# Altium schematic sheet payload_esp32.SchDoc (part 2 of 4)
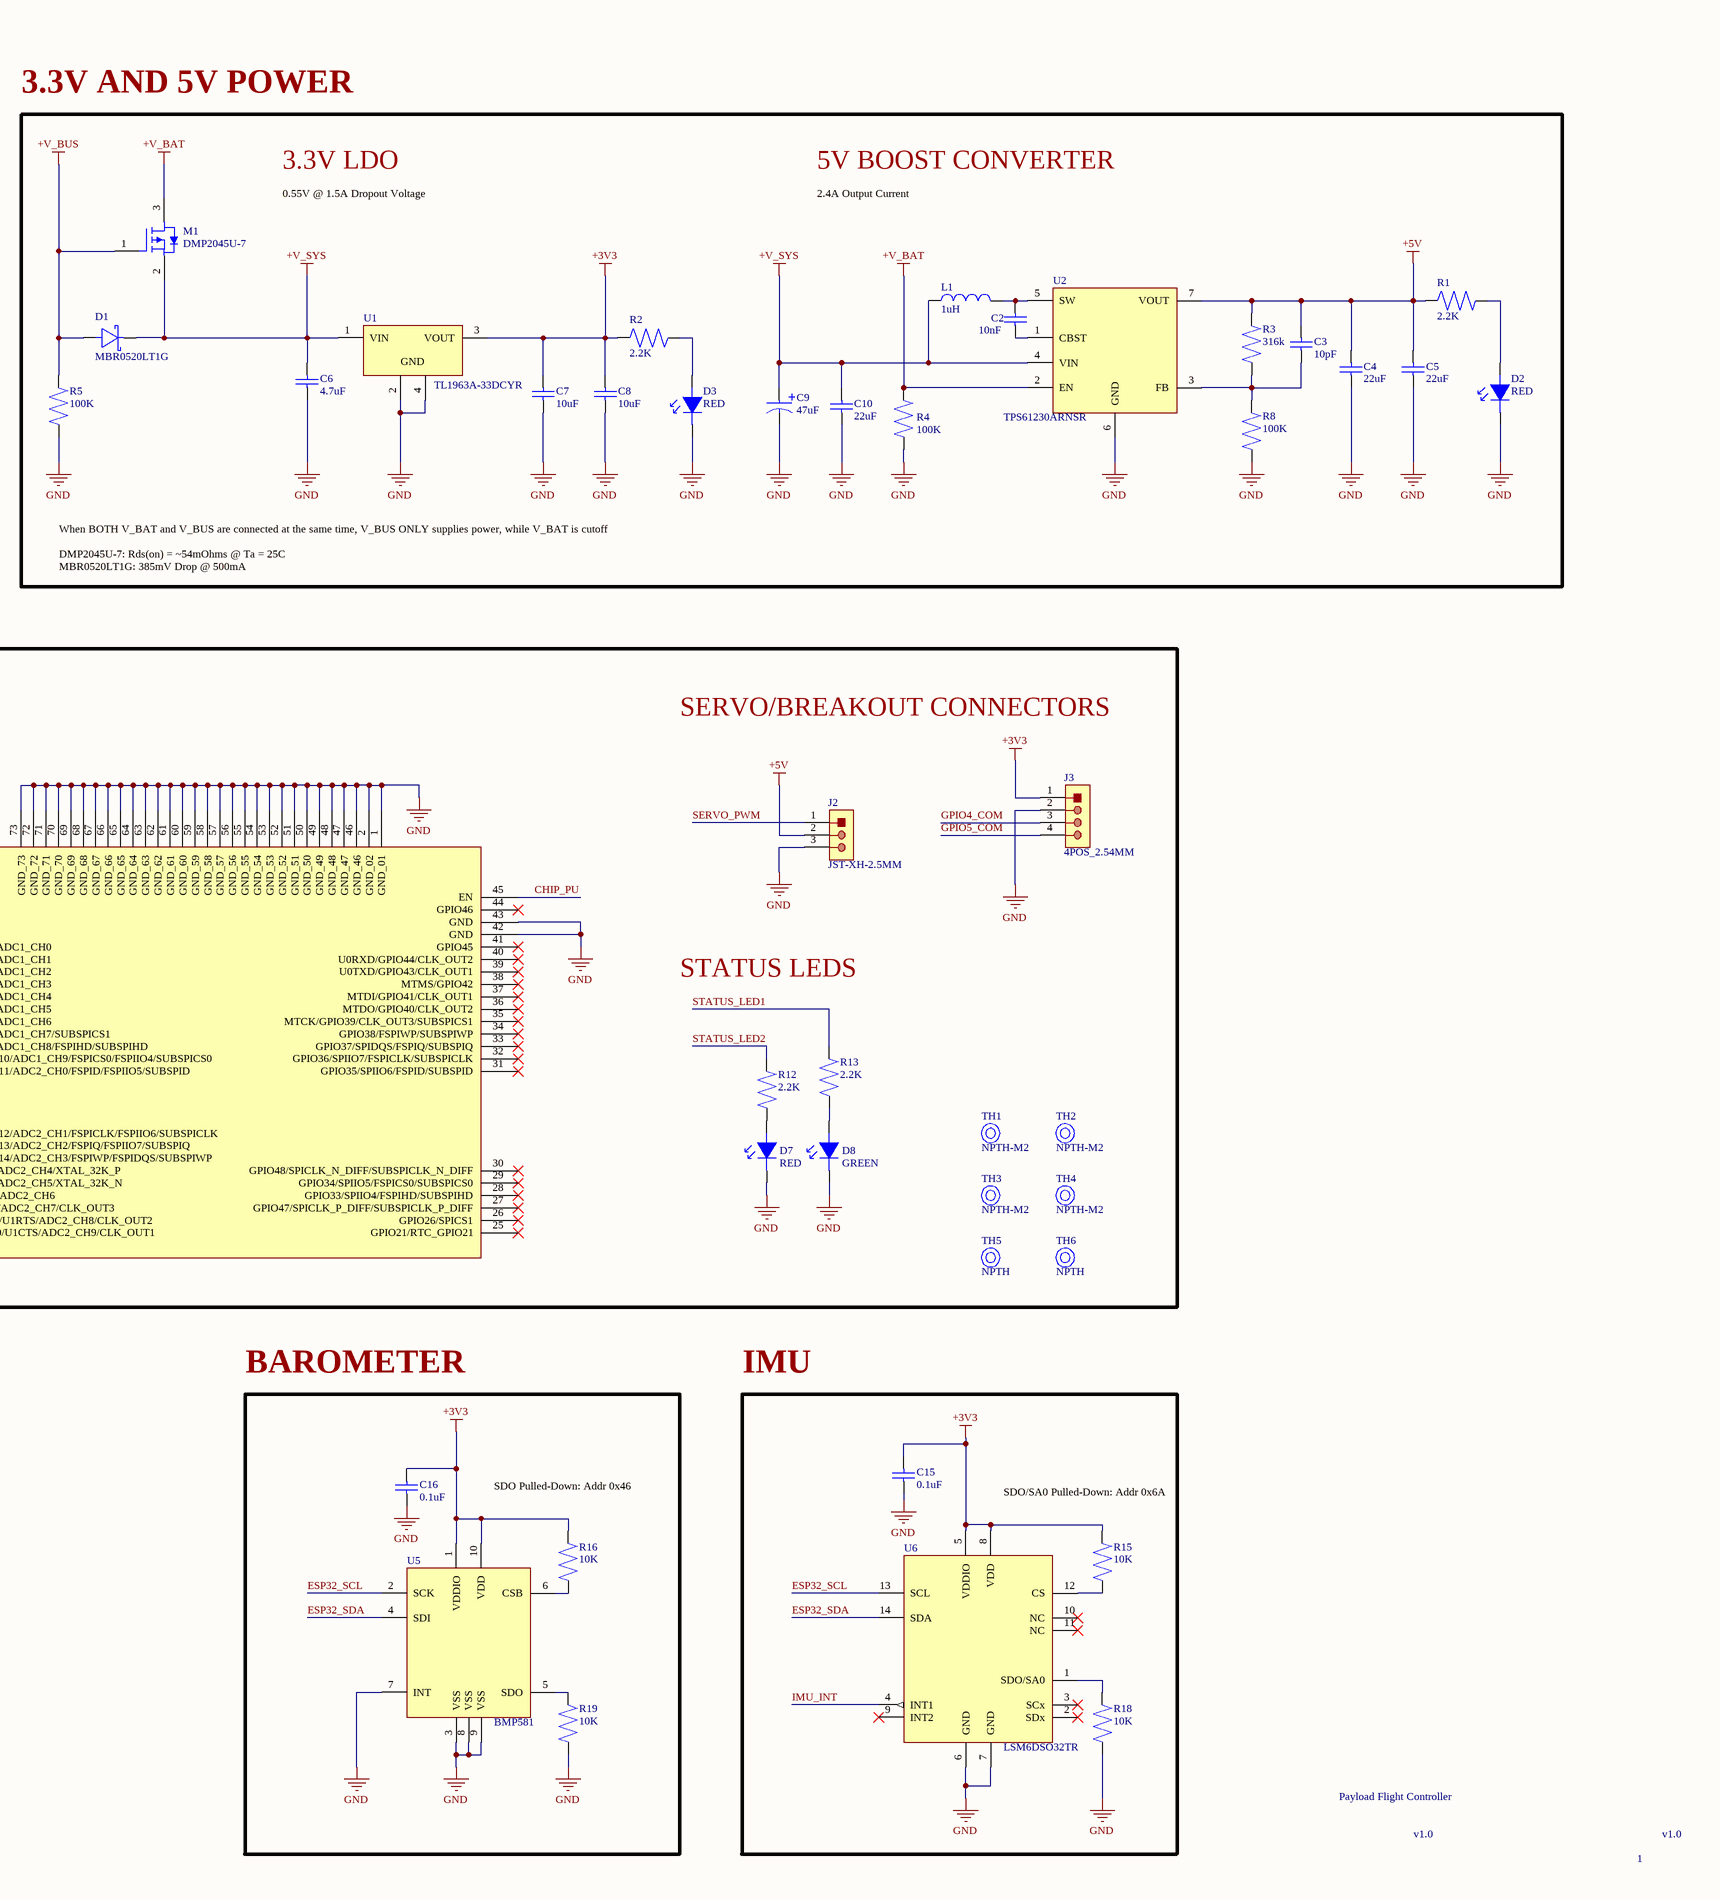
[diagram p2: payload_esp32.SchDoc, right]
## Library data of the parts
C1 C12 C14-C16 = CL05A104KP5NNNC: CAP CER 0.1UF 10V X5R 0402; Manufacturer: Samsung Electro-Mechanics; Value: 100nF; Dielectric Material: Ceramic; Tolerance: 10%; Supplier: DigiKey; Supplier Part Number: 1276-1022-1-ND; Manufacturer Part Number: CL05A104KP5NNNC; RoHS: Compliant; Category: Ceramic Capacitors; Stock: 423340; Pricing: 1=0.1, 10=0.018, 50=0.0118, 100=0.0099, 500=0.00686, 1000=0.00591, 2500=0.00494, 5000=0.00435 (USD); Case/Package: 0402; Case Code (Imperial): 0402; Case Code (Metric): 1005; China RoHS: Compliant; Contact Plating: Tin; Country of Origin: Mainland China, Philippines, South Korea; Depth: 500µm; Dielectric: X5R; Export Control Classification Number (ECCN) Code: EAR99; Height: 550µm; Harmonized Tariff Schedule (HTS) Code: 8532.24.00.20; Introduction Date: 2005-12-01; Length: 1mm; Lifecycle Status: Production; Material: Ceramic; Max Operating Temperature: 85°C; Min Operating Temperature: -55°C; Mounting Technology: Surface Mount; Number of Terminals: 2; Radiation Hardening: No; REACH SVHC: Yes; Schedule B: 8532240020, 8532240020|8532240020, 8532240020|8532240020|8532240020, 8532240020|8532240020|8532240020|8532240020; Thickness: 558.8µm; Voltage Rating: 10V; Voltage Rating (DC): 10V; Width: 500µm; ComponentLink1URL: https://datasheet.octopart.com:443/CL05A104KP5NNNC-Samsung-Electro-Mechanics-datasheet-136031717.pdf?src-supplier=IHS; ComponentLink1Description: https://datasheet.octopart.com:443/CL05A104KP5NNNC-Samsung-Electro-Mechanics-datasheet-136031717.pdf?src-supplier=IHS; ComponentLink2URL: https://datasheet.octopart.com:443/CL05A104KP5NNNC-Samsung-Electro-Mechanics-datasheet-11780788.pdf?src-supplier=Future+Electronics; ComponentLink2Description: https://datasheet.octopart.com:443/CL05A104KP5NNNC-Samsung-Electro-Mechanics-datasheet-11780788.pdf?src-supplier=Future+Electronics; ComponentLink3URL: https://datasheet.octopart.com:443/CL05A104KP5NNNC-Samsung-Electro-Mechanics-datasheet-110226197.pdf?src-supplier=Future+Electronics; ComponentLink3Description: https://datasheet.octopart.com:443/CL05A104KP5NNNC-Samsung-Electro-Mechanics-datasheet-110226197.pdf?src-supplier=Future+Electronics; ComponentLink4URL: https://datasheet.octopart.com:443/CL05A104KP5NNNC-Samsung-Electro-Mechanics-datasheet-81461587.pdf?src-supplier=Future+Electronics; ComponentLink4Description: https://datasheet.octopart.com:443/CL05A104KP5NNNC-Samsung-Electro-Mechanics-datasheet-81461587.pdf?src-supplier=Future+Electronics; ComponentLink5URL: https://datasheet.octopart.com:443/CL05A104KP5NNNC-Samsung-datasheet-42280511.pdf?src-supplier=Future+Electronics; ComponentLink5Description: https://datasheet.octopart.com:443/CL05A104KP5NNNC-Samsung-datasheet-42280511.pdf?src-supplier=Future+Electronics; ComponentLink6URL: https://datasheet.octopart.com:443/CL05A104KP5NNNC-Samsung-Electro-Mechanics-datasheet-149136630.pdf?src-supplier=Future+Electronics; ComponentLink6Description: https://datasheet.octopart.com:443/CL05A104KP5NNNC-Samsung-Electro-Mechanics-datasheet-149136630.pdf?src-supplier=Future+Electronics; ComponentLink7URL: https://datasheet.octopart.com/CL05A104KP5NNNC-Samsung-Electro-Mechanics-datasheet-8324245.pdf; ComponentLink7Description: https://datasheet.octopart.com/CL05A104KP5NNNC-Samsung-Electro-Mechanics-datasheet-8324245.pdf; ComponentLink8URL: https://datasheet.octopart.com/CL05A104KP5NNNC-Samsung-Electro-Mechanics-datasheet-97040617.pdf; ComponentLink8Description: https://datasheet.octopart.com/CL05A104KP5NNNC-Samsung-Electro-Mechanics-datasheet-97040617.pdf; ComponentLink9URL: https://datasheet.octopart.com:443/CL05A104KP5NNNC-Samsung-datasheet-59220082.pdf?src-supplier=TME; ComponentLink9Description: https://datasheet.octopart.com:443/CL05A104KP5NNNC-Samsung-datasheet-59220082.pdf?src-supplier=TME
C2 = GRM155R71C103KA01D: CAP CER 10000PF 16V X7R 0402; Manufacturer: Murata; Manufacturer Lifecycle Status: NRND; Dielectric Material: Ceramic; Tolerance: 10%; Supplier: DigiKey; Supplier Part Number: 490-1313-1-ND; Manufacturer Part Number: GRM155R71C103KA01D; RoHS: Compliant; Category: Ceramic Capacitors; Stock: 5833913; Pricing: 1=0.1, 10=0.021, 50=0.014, 100=0.0118, 500=0.00822, 1000=0.00713, 2500=0.00598, 5000=0.00529, 10000=0.0046, 20000=0.00415, 30000=0.00392, 50000=0.00367, 70000=0.00353, 100000=0.00339 (USD); Value: 10nF; Case/Package: 0402; Case Code (Imperial): 0402; Case Code (Metric): 1005; Depth: 500µm; Dielectric: X7R; Height: 500µm; Lead Free: Lead Free; Length: 1mm; Lifecycle Status: NRND; Material: Ceramic; Max Operating Temperature: 125°C; Min Operating Temperature: -55°C; Mounting Technology: Surface Mount; Pins: 2; Number of Terminals: 2; Packaging: Cut Tape; Radiation Hardening: No; REACH SVHC: Yes; Schedule B: 8532240020, 8532240020|8532240020, 8532240020|8532240020|8532240020, 8532240020|8532240020|8532240020|8532240020; Termination: SMD/SMT; Thickness: 500µm; Voltage: 16V; Voltage Rating: 16V; Voltage Rating (DC): 16V; Width: 500µm; ComponentLink1URL: https://datasheet.octopart.com:443/GRM155R71C103KA01D-Murata-datasheet-8817987.pdf?src-supplier=element14+APAC; ComponentLink1Description: https://datasheet.octopart.com:443/GRM155R71C103KA01D-Murata-datasheet-8817987.pdf?src-supplier=element14+APAC; ComponentLink2URL: https://datasheet.octopart.com:443/GRM155R71C103KA01D-Murata-datasheet-62317116.pdf?src-supplier=element14+APAC; ComponentLink2Description: https://datasheet.octopart.com:443/GRM155R71C103KA01D-Murata-datasheet-62317116.pdf?src-supplier=element14+APAC; ComponentLink3URL: https://datasheet.octopart.com:443/GRM155R71C103KA01D-Murata-datasheet-12547956.pdf?src-supplier=_legacy+Avnet; ComponentLink3Description: https://datasheet.octopart.com:443/GRM155R71C103KA01D-Murata-datasheet-12547956.pdf?src-supplier=_legacy+Avnet; ComponentLink4URL: https://datasheet.octopart.com:443/GRM155R71C103KA01D-Murata-datasheet-8330587.pdf?src-supplier=_legacy+Avnet; ComponentLink4Description: https://datasheet.octopart.com:443/GRM155R71C103KA01D-Murata-datasheet-8330587.pdf?src-supplier=_legacy+Avnet; ComponentLink5URL: https://datasheet.octopart.com:443/GRM155R71C103KA01D-Murata-datasheet-165579666.pdf?src-supplier=TME; ComponentLink5Description: https://datasheet.octopart.com:443/GRM155R71C103KA01D-Murata-datasheet-165579666.pdf?src-supplier=TME; ComponentLink6URL: https://datasheet.octopart.com:443/GRM155R71C103KA01D-Murata-datasheet-59876780.pdf?src-supplier=TME; ComponentLink6Description: https://datasheet.octopart.com:443/GRM155R71C103KA01D-Murata-datasheet-59876780.pdf?src-supplier=TME; ComponentLink7URL: https://datasheet.octopart.com:443/GRM155R71C103KA01D-Murata-datasheet-141266224.pdf?src-supplier=Ciiva; ComponentLink7Description: https://datasheet.octopart.com:443/GRM155R71C103KA01D-Murata-datasheet-141266224.pdf?src-supplier=Ciiva; ComponentLink8URL: https://datasheet.octopart.com:443/GRM155R71C103KA01D-Murata-datasheet-140690969.pdf?src-supplier=Ciiva; ComponentLink8Description: https://datasheet.octopart.com:443/GRM155R71C103KA01D-Murata-datasheet-140690969.pdf?src-supplier=Ciiva; ComponentLink9URL: https://datasheet.octopart.com:443/GRM155R71C103KA01D-Murata-datasheet-138740887.pdf?src-supplier=Ciiva; ComponentLink9Description: https://datasheet.octopart.com:443/GRM155R71C103KA01D-Murata-datasheet-138740887.pdf?src-supplier=Ciiva; ComponentLink10URL: https://datasheet.octopart.com:443/GRM155R71C103KA01D-Murata-datasheet-22122223.pdf?src-supplier=Future+Electronics; ComponentLink10Description: https://datasheet.octopart.com:443/GRM155R71C103KA01D-Murata-datasheet-22122223.pdf?src-supplier=Future+Electronics; ComponentLink11URL: https://datasheet.octopart.com:443/GRM155R71C103KA01D-Murata-datasheet-14400559.pdf?src-supplier=Future+Electronics; ComponentLink11Description: https://datasheet.octopart.com:443/GRM155R71C103KA01D-Murata-datasheet-14400559.pdf?src-supplier=Future+Electronics; ComponentLink12URL: https://datasheet.octopart.com:443/GRM155R71C103KA01D-Murata-datasheet-44106282.pdf?src-supplier=Future+Electronics; ComponentLink12Description: https://datasheet.octopart.com:443/GRM155R71C103KA01D-Murata-datasheet-44106282.pdf?src-supplier=Future+Electronics; ComponentLink13URL: https://datasheet.octopart.com/GRM155R71C103KA01D-Murata-datasheet-12515295.pdf; ComponentLink13Description: https://datasheet.octopart.com/GRM155R71C103KA01D-Murata-datasheet-12515295.pdf; ComponentLink14URL: https://datasheet.octopart.com/GRM155R71C103KA01D-Murata-datasheet-12510076.pdf; ComponentLink14Description: https://datasheet.octopart.com/GRM155R71C103KA01D-Murata-datasheet-12510076.pdf; ComponentLink15URL: https://datasheet.octopart.com/GRM155R71C103KA01D-Murata-datasheet-11978611.pdf; ComponentLink15Description: https://datasheet.octopart.com/GRM155R71C103KA01D-Murata-datasheet-11978611.pdf; ComponentLink16URL: https://datasheet.octopart.com/GRM155R71C103KA01D-Murata-datasheet-10025737.pdf; ComponentLink16Description: https://datasheet.octopart.com/GRM155R71C103KA01D-Murata-datasheet-10025737.pdf; ComponentLink17URL: https://datasheet.octopart.com/GRM155R71C103KA01D-Murata-datasheet-8819587.pdf; ComponentLink17Description: https://datasheet.octopart.com/GRM155R71C103KA01D-Murata-datasheet-8819587.pdf; ComponentLink18URL: https://datasheet.octopart.com/GRM155R71C103KA01D-Murata-datasheet-14400564.pdf; ComponentLink18Description: https://datasheet.octopart.com/GRM155R71C103KA01D-Murata-datasheet-14400564.pdf; ComponentLink19URL: https://datasheet.octopart.com:443/GRM155R71C103KA01D-Murata-datasheet-148211.pdf?src-supplier=Garrett; ComponentLink19Description: https://datasheet.octopart.com:443/GRM155R71C103KA01D-Murata-datasheet-148211.pdf?src-supplier=Garrett; ComponentLink20URL: https://datasheet.octopart.com:443/GRM155R71C103KA01D-Murata-datasheet-102.pdf?src-supplier=DigiKey; ComponentLink20Description: https://datasheet.octopart.com:443/GRM155R71C103KA01D-Murata-datasheet-102.pdf?src-supplier=DigiKey; ComponentLink21URL: http://sigma.octopart.com:80/reach_statement/Murata-company-16.pdf?src-supplier=Compliance+Statements; ComponentLink21Description: http://sigma.octopart.com:80/reach_statement/Murata-company-16.pdf?src-supplier=Compliance+Statements
C3 = GRM1885C1H100JA01D: CAP CER 10PF 50V C0G/NP0 0603; Manufacturer: Murata; Manufacturer Lifecycle Status: NRND; Dielectric: C0G; Dielectric Material: Ceramic; Insulation Resistance: 10GΩ; Temperature Coefficient: 30ppm/°C; Tolerance: 5%; Supplier: DigiKey; Supplier Part Number: 490-1403-1-ND; Manufacturer Part Number: GRM1885C1H100JA01D; RoHS: Compliant; Category: Ceramic Capacitors; Stock: 208082; Pricing: 1=0.12, 10=0.064, 50=0.0446, 100=0.0386, 500=0.02856, 1000=0.02546 (USD); Value: 10pF; Case/Package: 0603; Case Code (Imperial): 0603; Case Code (Metric): 1608; Depth: 800µm; Export Control Classification Number (ECCN) Code: EAR99; Height: 800µm; Harmonized Tariff Schedule (HTS) Code: 8532.24.00.20; Introduction Date: 2001-07-26; Lead Free: Lead Free; Length: 1.6mm; Lifecycle Status: NRND; Material: Ceramic; Max Operating Temperature: 125°C; Min Operating Temperature: -55°C; Mounting Technology: Surface Mount; Pins: 2; Number of Terminals: 2; Packaging: Cut Tape; Radiation Hardening: No; REACH SVHC: Yes; Schedule B: 8532240020, 8532240020|8532240020, 8532240020|8532240020|8532240020, 8532240020|8532240020|8532240020|8532240020; Termination: SMD/SMT; Thickness: 800µm; Voltage: 50V; Voltage Rating: 50V; Voltage Rating (DC): 50V; Width: 800µm; ComponentLink1URL: https://datasheet.octopart.com:443/GRM1885C1H100JA01D-Murata-datasheet-501912.pdf?src-supplier=element14+APAC; ComponentLink1Description: https://datasheet.octopart.com:443/GRM1885C1H100JA01D-Murata-datasheet-501912.pdf?src-supplier=element14+APAC; ComponentLink2URL: https://datasheet.octopart.com:443/GRM1885C1H100JA01D-Murata-datasheet-62320228.pdf?src-supplier=element14+APAC; ComponentLink2Description: https://datasheet.octopart.com:443/GRM1885C1H100JA01D-Murata-datasheet-62320228.pdf?src-supplier=element14+APAC; ComponentLink3URL: https://datasheet.octopart.com:443/GRM1885C1H100JA01D-Murata-datasheet-17853672.pdf?src-supplier=element14+APAC; ComponentLink3Description: https://datasheet.octopart.com:443/GRM1885C1H100JA01D-Murata-datasheet-17853672.pdf?src-supplier=element14+APAC; ComponentLink4URL: https://datasheet.octopart.com:443/GRM1885C1H100JA01D-Murata-datasheet-8326625.pdf?src-supplier=_legacy+Avnet; ComponentLink4Description: https://datasheet.octopart.com:443/GRM1885C1H100JA01D-Murata-datasheet-8326625.pdf?src-supplier=_legacy+Avnet; ComponentLink5URL: https://datasheet.octopart.com:443/GRM1885C1H100JA01D-Murata-datasheet-14397104.pdf?src-supplier=Future+Electronics; ComponentLink5Description: https://datasheet.octopart.com:443/GRM1885C1H100JA01D-Murata-datasheet-14397104.pdf?src-supplier=Future+Electronics; ComponentLink6URL: https://datasheet.octopart.com:443/GRM1885C1H100JA01D-Murata-datasheet-22122223.pdf?src-supplier=Future+Electronics; ComponentLink6Description: https://datasheet.octopart.com:443/GRM1885C1H100JA01D-Murata-datasheet-22122223.pdf?src-supplier=Future+Electronics; ComponentLink7URL: https://datasheet.octopart.com:443/GRM1885C1H100JA01D-Murata-datasheet-44106814.pdf?src-supplier=Future+Electronics; ComponentLink7Description: https://datasheet.octopart.com:443/GRM1885C1H100JA01D-Murata-datasheet-44106814.pdf?src-supplier=Future+Electronics; ComponentLink8URL: https://datasheet.octopart.com:443/GRM1885C1H100JA01D-Murata-datasheet-165579666.pdf?src-supplier=TME; ComponentLink8Description: https://datasheet.octopart.com:443/GRM1885C1H100JA01D-Murata-datasheet-165579666.pdf?src-supplier=TME; ComponentLink9URL: https://datasheet.octopart.com:443/GRM1885C1H100JA01D-Murata-datasheet-59876780.pdf?src-supplier=TME; ComponentLink9Description: https://datasheet.octopart.com:443/GRM1885C1H100JA01D-Murata-datasheet-59876780.pdf?src-supplier=TME; ComponentLink10URL: https://datasheet.octopart.com:443/GRM1885C1H100JA01D-Murata-datasheet-141274262.pdf?src-supplier=Ciiva; ComponentLink10Description: https://datasheet.octopart.com:443/GRM1885C1H100JA01D-Murata-datasheet-141274262.pdf?src-supplier=Ciiva; ComponentLink11URL: https://datasheet.octopart.com:443/GRM1885C1H100JA01D-Murata-datasheet-140695805.pdf?src-supplier=Ciiva; ComponentLink11Description: https://datasheet.octopart.com:443/GRM1885C1H100JA01D-Murata-datasheet-140695805.pdf?src-supplier=Ciiva; ComponentLink12URL: https://datasheet.octopart.com:443/GRM1885C1H100JA01D-Murata-datasheet-138741453.pdf?src-supplier=Ciiva; ComponentLink12Description: https://datasheet.octopart.com:443/GRM1885C1H100JA01D-Murata-datasheet-138741453.pdf?src-supplier=Ciiva; ComponentLink13URL: https://datasheet.octopart.com/GRM1885C1H100JA01D-Murata-datasheet-12515295.pdf; ComponentLink13Description: https://datasheet.octopart.com/GRM1885C1H100JA01D-Murata-datasheet-12515295.pdf; ComponentLink14URL: https://datasheet.octopart.com/GRM1885C1H100JA01D-Murata-datasheet-12510076.pdf; ComponentLink14Description: https://datasheet.octopart.com/GRM1885C1H100JA01D-Murata-datasheet-12510076.pdf; ComponentLink15URL: https://datasheet.octopart.com/GRM1885C1H100JA01D-Murata-datasheet-11978611.pdf; ComponentLink15Description: https://datasheet.octopart.com/GRM1885C1H100JA01D-Murata-datasheet-11978611.pdf; ComponentLink16URL: https://datasheet.octopart.com/GRM1885C1H100JA01D-Murata-datasheet-10025737.pdf; ComponentLink16Description: https://datasheet.octopart.com/GRM1885C1H100JA01D-Murata-datasheet-10025737.pdf; ComponentLink17URL: https://datasheet.octopart.com/GRM1885C1H100JA01D-Murata-datasheet-8819587.pdf; ComponentLink17Description: https://datasheet.octopart.com/GRM1885C1H100JA01D-Murata-datasheet-8819587.pdf; ComponentLink18URL: https://datasheet.octopart.com:443/GRM1885C1H100JA01D-Murata-datasheet-8213623.pdf?src-supplier=Jameco; ComponentLink18Description: https://datasheet.octopart.com:443/GRM1885C1H100JA01D-Murata-datasheet-8213623.pdf?src-supplier=Jameco; ComponentLink19URL: https://datasheet.octopart.com:443/GRM1885C1H100JA01D-Murata-datasheet-102.pdf?src-supplier=DigiKey; ComponentLink19Description: https://datasheet.octopart.com:443/GRM1885C1H100JA01D-Murata-datasheet-102.pdf?src-supplier=DigiKey; ComponentLink20URL: https://datasheet.octopart.com:443/GRM1885C1H100JA01D-Murata-datasheet-514334.pdf?src-supplier=Farnell; ComponentLink20Description: https://datasheet.octopart.com:443/GRM1885C1H100JA01D-Murata-datasheet-514334.pdf?src-supplier=Farnell; ComponentLink21URL: http://sigma.octopart.com:80/reach_statement/Murata-company-16.pdf?src-supplier=Compliance+Statements; ComponentLink21Description: http://sigma.octopart.com:80/reach_statement/Murata-company-16.pdf?src-supplier=Compliance+Statements
C4 C5 C10 = GRM21BR61A226ME44L: CAP CER 22UF 10V X5R 0805; Manufacturer: Murata; Manufacturer Lifecycle Status: IN PRODUCTION; Value: 22µF; Dielectric Material: Ceramic; Dissipation Factor: 0.035%; Tolerance: 20%; Supplier: DigiKey; Supplier Part Number: 490-10746-1-ND; Manufacturer Part Number: GRM21BR61A226ME44L; RoHS: Compliant; Category: Ceramic Capacitors; Stock: 89098; Pricing: 1=0.29, 10=0.17, 50=0.1232, 100=0.1091, 500=0.0852, 1000=0.07783 (USD); Case/Package: 0805; Case Code (Imperial): 0805; Case Code (Metric): 2012; Composition: Ceramic; Country of Origin: Philippines; Depth: 1.25mm; Dielectric: X5R; Export Control Classification Number (ECCN) Code: EAR99; Height: 1.25mm; Harmonized Tariff Schedule (HTS) Code: 8532.24.00.20; Introduction Date: 2013-11-20; Lead Free: Lead Free; Length: 2mm; Lifecycle Status: Production; Material: Ceramic; Max Operating Temperature: 85°C; Min Operating Temperature: -55°C; Mounting Technology: Surface Mount; Number of Terminals: 2; REACH SVHC: Yes; Schedule B: 8532240020, 8532240020|8532240020, 8532240020|8532240020|8532240020, 8532240020|8532240020|8532240020|8532240020; Termination: SMD/SMT; Thickness: 1.25mm; Voltage: 10V; Voltage Rating: 10V; Voltage Rating (DC): 10V; Weight: 9.49709mg; Width: 1.25mm; ComponentLink1URL: https://datasheet.octopart.com:443/GRM21BR61A226ME44L-Murata-datasheet-149523488.pdf?src-supplier=Newark; ComponentLink1Description: https://datasheet.octopart.com:443/GRM21BR61A226ME44L-Murata-datasheet-149523488.pdf?src-supplier=Newark; ComponentLink2URL: https://datasheet.octopart.com:443/GRM21BR61A226ME44L-Murata-datasheet-141278166.pdf?src-supplier=Geoflip; ComponentLink2Description: https://datasheet.octopart.com:443/GRM21BR61A226ME44L-Murata-datasheet-141278166.pdf?src-supplier=Geoflip; ComponentLink3URL: https://datasheet.octopart.com:443/GRM21BR61A226ME44L-Murata-datasheet-179128090.pdf?src-supplier=Arrow.cn; ComponentLink3Description: https://datasheet.octopart.com:443/GRM21BR61A226ME44L-Murata-datasheet-179128090.pdf?src-supplier=Arrow.cn; ComponentLink4URL: https://datasheet.octopart.com:443/GRM21BR61A226ME44L-Murata-datasheet-165579666.pdf?src-supplier=TME; ComponentLink4Description: https://datasheet.octopart.com:443/GRM21BR61A226ME44L-Murata-datasheet-165579666.pdf?src-supplier=TME; ComponentLink5URL: https://datasheet.octopart.com:443/GRM21BR61A226ME44L-Murata-datasheet-140707521.pdf?src-supplier=Ciiva; ComponentLink5Description: https://datasheet.octopart.com:443/GRM21BR61A226ME44L-Murata-datasheet-140707521.pdf?src-supplier=Ciiva; ComponentLink6URL: https://datasheet.octopart.com:443/GRM21BR61A226ME44L-Murata-datasheet-138744833.pdf?src-supplier=Ciiva; ComponentLink6Description: https://datasheet.octopart.com:443/GRM21BR61A226ME44L-Murata-datasheet-138744833.pdf?src-supplier=Ciiva; ComponentLink7URL: https://datasheet.octopart.com:443/GRM21BR61A226ME44L-Murata-datasheet-102370999.pdf?src-supplier=HQonline; ComponentLink7Description: https://datasheet.octopart.com:443/GRM21BR61A226ME44L-Murata-datasheet-102370999.pdf?src-supplier=HQonline; ComponentLink8URL: https://datasheet.octopart.com/GRM21BR61A226ME44L-Murata-datasheet-12515295.pdf; ComponentLink8Description: https://datasheet.octopart.com/GRM21BR61A226ME44L-Murata-datasheet-12515295.pdf; ComponentLink9URL: https://datasheet.octopart.com/GRM21BR61A226ME44L-Murata-datasheet-12510076.pdf; ComponentLink9Description: https://datasheet.octopart.com/GRM21BR61A226ME44L-Murata-datasheet-12510076.pdf; ComponentLink10URL: https://datasheet.octopart.com/GRM21BR61A226ME44L-Murata-datasheet-11978611.pdf; ComponentLink10Description: https://datasheet.octopart.com/GRM21BR61A226ME44L-Murata-datasheet-11978611.pdf; ComponentLink11URL: https://datasheet.octopart.com/GRM21BR61A226ME44L-Murata-datasheet-10025737.pdf; ComponentLink11Description: https://datasheet.octopart.com/GRM21BR61A226ME44L-Murata-datasheet-10025737.pdf; ComponentLink12URL: https://datasheet.octopart.com/GRM21BR61A226ME44L-Murata-datasheet-8819587.pdf; ComponentLink12Description: https://datasheet.octopart.com/GRM21BR61A226ME44L-Murata-datasheet-8819587.pdf; ComponentLink13URL: https://datasheet.octopart.com/GRM21BR61A226ME44L-Murata-datasheet-38883387.pdf; ComponentLink13Description: https://datasheet.octopart.com/GRM21BR61A226ME44L-Murata-datasheet-38883387.pdf; ComponentLink14URL: https://datasheet.octopart.com:443/GRM21BR61A226ME44L-Murata-datasheet-62287469.pdf?src-supplier=Future+Electronics; ComponentLink14Description: https://datasheet.octopart.com:443/GRM21BR61A226ME44L-Murata-datasheet-62287469.pdf?src-supplier=Future+Electronics; ComponentLink15URL: http://sigma.octopart.com:80/reach_statement/Murata-company-16.pdf?src-supplier=Compliance+Statements; ComponentLink15Description: http://sigma.octopart.com:80/reach_statement/Murata-company-16.pdf?src-supplier=Compliance+Statements
C6 = CC0402MRX5R6BB475: CAP CER 4.7UF 10V X5R 0402; Manufacturer: Yageo; Dielectric Material: Ceramic; Multilayer: Yes; Tolerance  (fill in as +-): 20%; Supplier: Digikey; Supplier Part Number: 311-1734-1-ND; Manufacturer Part Number: CC0402MRX5R6BB475; RoHS: Yes; Category: Ceramic Capacitors; Stock: 760986; Pricing: 1=0.08, 10=0.041, 100=0.0248, 1000=0.0168, 2500=0.0128 (USD); Mounting Technology: Surface Mount; Pins: 2; Package Shape: Rectangular; Case/Package: 0402; Terminal Finish: Nickel; Min Operating Temperature: -55°C; Max Operating Temperature: 85°C; JESD-609 Code: e3; Value: 4.7uF; Capacitor Type: Ceramic; Package Style: SMTMeter; Packaging: Tape and Reel; Tolerance (fill in as +-): 20%; Rated DC Voltage (URdc): 10V; Temperature Characteristics Code: X5R; Termination: Wraparound; Length: 1mm; Width: 0.5mm; Height: 0.5mm; Reach SVHC Compliant: Yes; RoHS Compliant: Yes; ComponentLink1URL: https://datasheet.ciiva.com:443/pdfs/VipMasterIC/IC/YAGO/YAGO-S-A0006851646/YAGO-S-A0006851646-1.pdf?src-supplier=IHS+Markit; ComponentLink1Description: https://datasheet.ciiva.com:443/pdfs/VipMasterIC/IC/YAGO/YAGO-S-A0006851646/YAGO-S-A0006851646-1.pdf?src-supplier=IHS+Markit; ComponentLink2URL: http://www.mouser.com/ds/2/447/Yageo_UPY-GP_NP0_16V-to-50V_9-358835.pdf?src-supplier=Mouser; ComponentLink2Description: http://www.mouser.com/ds/2/447/Yageo_UPY-GP_NP0_16V-to-50V_9-358835.pdf?src-supplier=Mouser; ComponentLink3URL: http://www.yageo.com/documents/recent/UPY-GPHC_X5R_4V-to-50V_25.pdf?src-supplier=Digikey; ComponentLink3Description: http://www.yageo.com/documents/recent/UPY-GPHC_X5R_4V-to-50V_25.pdf?src-supplier=Digikey; ComponentLink4URL: http://www.yageo.com/exep/pages/download/literatures/ProductSelectionGuide%202014_Final_2.pdf?src-supplier=Digikey; ComponentLink4Description: http://www.yageo.com/exep/pages/download/literatures/ProductSelectionGuide%202014_Final_2.pdf?src-supplier=Digikey; ComponentLink5URL: https://datasheet.octopart.com/CC0402MRX5R6BB475-Yageo-datasheet-140260304.pdf?src-supplier=Newark; ComponentLink5Description: https://datasheet.octopart.com/CC0402MRX5R6BB475-Yageo-datasheet-140260304.pdf?src-supplier=Newark; ComponentLink6URL: https://datasheet.octopart.com/CC0402MRX5R6BB475-Yageo-datasheet-182029487.pdf?src-supplier=Farnell; ComponentLink6Description: https://datasheet.octopart.com/CC0402MRX5R6BB475-Yageo-datasheet-182029487.pdf?src-supplier=Farnell; ComponentLink7URL: https://datasheet.octopart.com/CC0402MRX5R6BB475-Yageo-datasheet-182029487.pdf?src-supplier=Element14; ComponentLink7Description: https://datasheet.octopart.com/CC0402MRX5R6BB475-Yageo-datasheet-182029487.pdf?src-supplier=Element14
C7 C8 C11 = CC0402MRX5R6BB106: CAP CER 10UF 10V X5R 0402; Manufacturer: Yageo; Dielectric Material: Ceramic; Multilayer: Yes; Tolerance  (fill in as +-): 20%; Supplier: Digikey; Supplier Part Number: 13-CC0402MRX5R6BB106CT-ND; Manufacturer Part Number: CC0402MRX5R6BB106; RoHS: Yes; Category: Ceramic Capacitors; Stock: 154869; Pricing: 1=0.21, 10=0.121, 100=0.076, 1000=0.05277, 2500=0.04701, 5000=0.04354, 10000=0.04023, 20000=0.03833, 30000=0.03716, 50000=0.03585, 70000=0.03509, 100000=0.03436, 250000=0.03395 (USD); Mounting Technology: Surface Mount; Pins: 2; Package Shape: Rectangular; Case/Package: 0402; Terminal Finish: Tin; Min Operating Temperature: -55°C; Max Operating Temperature: 85°C; JESD-609 Code: e3; Value: 10uF; Capacitor Type: Ceramic; Packaging: Tape and Reel; Tolerance (fill in as +-): 20%; Rated DC Voltage (URdc): 10V; Temperature Characteristics Code: X5R; Termination: Wraparound; Reach SVHC Compliant: Yes; RoHS Compliant: Yes; ComponentLink1URL: https://datasheet.ciiva.com:443/pdfs/VipMasterIC/IC/YAGO/YAGO-S-A0003444379/YAGO-S-A0003444379-1.pdf?src-supplier=IHS+Markit; ComponentLink1Description: https://datasheet.ciiva.com:443/pdfs/VipMasterIC/IC/YAGO/YAGO-S-A0003444379/YAGO-S-A0003444379-1.pdf?src-supplier=IHS+Markit; ComponentLink2URL: https://datasheet.octopart.com/CC0402MRX5R6BB106-Yageo-datasheet-175963154.pdf?src-supplier=Element14; ComponentLink2Description: https://datasheet.octopart.com/CC0402MRX5R6BB106-Yageo-datasheet-175963154.pdf?src-supplier=Element14; ComponentLink3URL: http://www.yageo.com/documents/recent/UPY-GPHC_X5R_4V-to-50V_25.pdf?src-supplier=Digikey; ComponentLink3Description: http://www.yageo.com/documents/recent/UPY-GPHC_X5R_4V-to-50V_25.pdf?src-supplier=Digikey; ComponentLink4URL: https://datasheet.octopart.com/CC0402MRX5R6BB106-Yageo-datasheet-170350636.pdf?src-supplier=Future+Electronics; ComponentLink4Description: https://datasheet.octopart.com/CC0402MRX5R6BB106-Yageo-datasheet-170350636.pdf?src-supplier=Future+Electronics; ComponentLink5URL: https://datasheet.octopart.com/CC0402MRX5R6BB106-Yageo-datasheet-182029486.pdf?src-supplier=Farnell; ComponentLink5Description: https://datasheet.octopart.com/CC0402MRX5R6BB106-Yageo-datasheet-182029486.pdf?src-supplier=Farnell; ComponentLink6URL: https://datasheet.octopart.com/CC0402MRX5R6BB106-Yageo-datasheet-158238148.pdf?src-supplier=Newark; ComponentLink6Description: https://datasheet.octopart.com/CC0402MRX5R6BB106-Yageo-datasheet-158238148.pdf?src-supplier=Newark
C9 = UCM1V470MCL1GS: CAP ALUM 47UF 20% 35V SMD; Manufacturer: Nichicon; Value: 47µF; Impedance: 360mΩ; Leakage Current: 16.45µA; Life (Hours): 2000hours; Polarity: Polar; Ripple Current: 120mA; Ripple Current (AC): 240mA; Supplier: DigiKey; Supplier Part Number: 493-14540-1-ND; Manufacturer Part Number: UCM1V470MCL1GS; RoHS: Compliant; Category: Aluminum Electrolytic Capacitors; Stock: 36442; Pricing: 1=0.46, 10=0.283, 50=0.2088, 100=0.1852, 500=0.14418 (USD); Case/Package: SMD/SMT; China RoHS: Compliant; Contact Plating: Tin; Country of Origin: Japan; Diameter: 5mm; Export Control Classification Number (ECCN) Code: EAR99; Height: 5.8mm; Height - Seated (Max): 6.096mm; Harmonized Tariff Schedule (HTS) Code: 8532.22.00; Introduction Date: 2012-09-25; Lead Pitch: 1.3mm; Length: 5.3mm; Lifecycle Status: Production; Max Operating Temperature: 105°C; Min Operating Temperature: -55°C; Mounting Technology: Surface Mount; Number of Terminals: 2; Ratings: AEC-Q200; REACH SVHC: No; Schedule B: 8532220020, 8532220020|8532220020|8532220020|8532220020|8532220020; Termination: SMD/SMT; Tolerance: 20%; Voltage: 35V; Voltage Rating: 35V; Voltage Rating (DC): 35V; Weight: 200.005886mg; Width: 5.3mm; ComponentLink1URL: https://datasheet.octopart.com:443/UCM1V470MCL1GS-Nichicon-datasheet-169250457.pdf?src-supplier=IHS; ComponentLink1Description: https://datasheet.octopart.com:443/UCM1V470MCL1GS-Nichicon-datasheet-169250457.pdf?src-supplier=IHS; ComponentLink2URL: https://datasheet.octopart.com:443/UCM1V470MCL1GS-Nichicon-datasheet-142025546.pdf?src-supplier=ODG+(Origin+Data+Global); ComponentLink2Description: https://datasheet.octopart.com:443/UCM1V470MCL1GS-Nichicon-datasheet-142025546.pdf?src-supplier=ODG+(Origin+Data+Global); ComponentLink3URL: https://datasheet.octopart.com:443/UCM1V470MCL1GS-Nichicon-datasheet-67209974.pdf?src-supplier=HQonline; ComponentLink3Description: https://datasheet.octopart.com:443/UCM1V470MCL1GS-Nichicon-datasheet-67209974.pdf?src-supplier=HQonline; ComponentLink4URL: https://datasheet.octopart.com:443/UCM1V470MCL1GS-Nichicon-datasheet-66487647.pdf?src-supplier=TME; ComponentLink4Description: https://datasheet.octopart.com:443/UCM1V470MCL1GS-Nichicon-datasheet-66487647.pdf?src-supplier=TME; ComponentLink5URL: https://datasheet.octopart.com:443/UCM1V470MCL1GS-Nichicon-datasheet-140567133.pdf?src-supplier=Arrow.cn; ComponentLink5Description: https://datasheet.octopart.com:443/UCM1V470MCL1GS-Nichicon-datasheet-140567133.pdf?src-supplier=Arrow.cn
C13 = CL05A105KO5NNNC: CAP CER 1UF 16V X5R 0402; Manufacturer: Samsung Electro-Mechanics; Value: 1µF; Dielectric Material: Ceramic; Tolerance: 10%; Supplier: DigiKey; Supplier Part Number: 1276-1067-1-ND; Manufacturer Part Number: CL05A105KO5NNNC; RoHS: Compliant; Category: Ceramic Capacitors; Stock: 8865925; Pricing: 1=0.1, 10=0.036, 50=0.024, 100=0.0205, 500=0.01466, 1000=0.01286, 2500=0.01097, 5000=0.00984, 10000=0.00891, 20000=0.00815, 30000=0.00777, 50000=0.00734, 70000=0.0071, 100000=0.00686 (USD); Case/Package: 0402; Case Code (Imperial): 0402; Case Code (Metric): 1005; China RoHS: Compliant; Contact Plating: Tin; Depth: 500µm; Dielectric: X5R; Height: 550µm; Length: 1mm; Lifecycle Status: Production; Material: Ceramic; Max Operating Temperature: 85°C; Min Operating Temperature: -55°C; Mounting Technology: Surface Mount; Number of Terminals: 2; Radiation Hardening: No; REACH SVHC: Yes; Schedule B: 8532240020, 8532240020|8532240020, 8532240020|8532240020|8532240020, 8532240020|8532240020|8532240020|8532240020; Thickness: 558.8µm; Voltage: 16V; Voltage Rating: 16V; Voltage Rating (DC): 16V; Width: 500µm; ComponentLink1URL: https://datasheet.octopart.com:443/CL05A105KO5NNNC-Samsung-Electro-Mechanics-datasheet-181960514.pdf?src-supplier=IHS; ComponentLink1Description: https://datasheet.octopart.com:443/CL05A105KO5NNNC-Samsung-Electro-Mechanics-datasheet-181960514.pdf?src-supplier=IHS; ComponentLink2URL: https://datasheet.octopart.com:443/CL05A105KO5NNNC-Samsung-Electro-Mechanics-datasheet-136031720.pdf?src-supplier=Samsung+SCT; ComponentLink2Description: https://datasheet.octopart.com:443/CL05A105KO5NNNC-Samsung-Electro-Mechanics-datasheet-136031720.pdf?src-supplier=Samsung+SCT; ComponentLink3URL: https://datasheet.octopart.com:443/CL05A105KO5NNNC-Samsung-Electro-Mechanics-datasheet-11776774.pdf?src-supplier=Future+Electronics; ComponentLink3Description: https://datasheet.octopart.com:443/CL05A105KO5NNNC-Samsung-Electro-Mechanics-datasheet-11776774.pdf?src-supplier=Future+Electronics; ComponentLink4URL: https://datasheet.octopart.com:443/CL05A105KO5NNNC-Samsung-Electro-Mechanics-datasheet-110226202.pdf?src-supplier=Future+Electronics; ComponentLink4Description: https://datasheet.octopart.com:443/CL05A105KO5NNNC-Samsung-Electro-Mechanics-datasheet-110226202.pdf?src-supplier=Future+Electronics; ComponentLink5URL: https://datasheet.octopart.com:443/CL05A105KO5NNNC-Samsung-Electro-Mechanics-datasheet-81461590.pdf?src-supplier=Future+Electronics; ComponentLink5Description: https://datasheet.octopart.com:443/CL05A105KO5NNNC-Samsung-Electro-Mechanics-datasheet-81461590.pdf?src-supplier=Future+Electronics; ComponentLink6URL: https://datasheet.octopart.com:443/CL05A105KO5NNNC-Samsung-datasheet-42280519.pdf?src-supplier=Future+Electronics; ComponentLink6Description: https://datasheet.octopart.com:443/CL05A105KO5NNNC-Samsung-datasheet-42280519.pdf?src-supplier=Future+Electronics; ComponentLink7URL: https://datasheet.octopart.com:443/CL05A105KO5NNNC-Samsung-datasheet-34152987.pdf?src-supplier=Future+Electronics; ComponentLink7Description: https://datasheet.octopart.com:443/CL05A105KO5NNNC-Samsung-datasheet-34152987.pdf?src-supplier=Future+Electronics; ComponentLink8URL: https://datasheet.octopart.com:443/CL05A105KO5NNNC-Samsung-datasheet-8329584.pdf?src-supplier=Future+Electronics; ComponentLink8Description: https://datasheet.octopart.com:443/CL05A105KO5NNNC-Samsung-datasheet-8329584.pdf?src-supplier=Future+Electronics; ComponentLink9URL: https://datasheet.octopart.com:443/CL05A105KO5NNNC-Samsung-Electro-Mechanics-datasheet-149136633.pdf?src-supplier=Future+Electronics; ComponentLink9Description: https://datasheet.octopart.com:443/CL05A105KO5NNNC-Samsung-Electro-Mechanics-datasheet-149136633.pdf?src-supplier=Future+Electronics; ComponentLink10URL: https://datasheet.octopart.com/CL05A105KO5NNNC-Samsung-Electro-Mechanics-datasheet-97040617.pdf; ComponentLink10Description: https://datasheet.octopart.com/CL05A105KO5NNNC-Samsung-Electro-Mechanics-datasheet-97040617.pdf; ComponentLink11URL: https://datasheet.octopart.com/CL05A105KO5NNNC-Samsung-Electro-Mechanics-datasheet-8324245.pdf; ComponentLink11Description: https://datasheet.octopart.com/CL05A105KO5NNNC-Samsung-Electro-Mechanics-datasheet-8324245.pdf; ComponentLink12URL: https://datasheet.octopart.com/General-Multilayer-Ceramic-Capacitors-Samsung-datasheet-family-111.pdf; ComponentLink12Description: https://datasheet.octopart.com/General-Multilayer-Ceramic-Capacitors-Samsung-datasheet-family-111.pdf; ComponentLink13URL: https://datasheet.octopart.com:443/CL05A105KO5NNNC-Samsung-datasheet-59220082.pdf?src-supplier=TME; ComponentLink13Description: https://datasheet.octopart.com:443/CL05A105KO5NNNC-Samsung-datasheet-59220082.pdf?src-supplier=TME; ComponentLink14URL: http://sigma.octopart.com:80/rohs_certificate/General-Multilayer-Ceramic-Capacitors-Samsung-family-110.pdf?src-supplier=Compliance+Statements; ComponentLink14Description: http://sigma.octopart.com:80/rohs_certificate/General-Multilayer-Ceramic-Capacitors-Samsung-family-110.pdf?src-supplier=Compliance+Statements; ComponentLink15URL: http://sigma.octopart.com:80/rohs_statement/General-Multilayer-Ceramic-Capacitors-Samsung-family-132.pdf?src-supplier=Compliance+Statements; ComponentLink15Description: http://sigma.octopart.com:80/rohs_statement/General-Multilayer-Ceramic-Capacitors-Samsung-family-132.pdf?src-supplier=Compliance+Statements; ComponentLink16URL: http://sigma.octopart.com:80/reach_statement/General-Multilayer-Ceramic-Capacitors-Samsung-family-133.pdf?src-supplier=Compliance+Statements; ComponentLink16Description: http://sigma.octopart.com:80/reach_statement/General-Multilayer-Ceramic-Capacitors-Samsung-family-133.pdf?src-supplier=Compliance+Statements
C17 = GRM188R72A104KA35D: CAP CER 0.1UF 100V X7R 0603; Manufacturer: Murata; Manufacturer Lifecycle Status: IN PRODUCTION; Value: 100nF; Dielectric Material: Ceramic; Tolerance: 10%; Supplier: DigiKey; Supplier Part Number: 490-3285-1-ND; Manufacturer Part Number: GRM188R72A104KA35D; RoHS: Compliant; Category: Ceramic Capacitors; Stock: 1466432; Pricing: 1=0.15, 10=0.083, 50=0.0584, 100=0.0508, 500=0.038, 1000=0.03406, 4000=0.02739, 8000=0.02527, 12000=0.02421, 20000=0.02304, 28000=0.02235, 40000=0.02169 (USD); Case/Package: 0603; Case Code (Imperial): 0603; Case Code (Metric): 1608; Country of Origin: Philippines; Depth: 800µm; Dielectric: X7R; Export Control Classification Number (ECCN) Code: EAR99; Height: 800µm; Harmonized Tariff Schedule (HTS) Code: 8532.24.00.20; Introduction Date: 2006-12-28; Lead Free: Lead Free; Length: 1.6mm; Lifecycle Status: Production; Material: Ceramic; Max Operating Temperature: 125°C; Min Operating Temperature: -55°C; Mounting Technology: Surface Mount; Pins: 2; Number of Terminals: 2; Packaging: Tape and Reel; Radiation Hardening: No; REACH SVHC: Yes; Schedule B: 8532240020, 8532240020|8532240020, 8532240020|8532240020|8532240020, 8532240020|8532240020|8532240020|8532240020; Termination: SMD/SMT; Thickness: 800µm; Voltage: 100V; Voltage Rating: 100V; Voltage Rating (DC): 100V; Weight: 6.293594mg; Width: 800µm; ComponentLink1URL: https://datasheet.octopart.com:443/GRM188R72A104KA35D-Murata-datasheet-44108070.pdf?src-supplier=Upverter; ComponentLink1Description: https://datasheet.octopart.com:443/GRM188R72A104KA35D-Murata-datasheet-44108070.pdf?src-supplier=Upverter; ComponentLink2URL: https://datasheet.octopart.com:443/GRM188R72A104KA35D-Murata-datasheet-141275792.pdf?src-supplier=Future+Electronics; ComponentLink2Description: https://datasheet.octopart.com:443/GRM188R72A104KA35D-Murata-datasheet-141275792.pdf?src-supplier=Future+Electronics; ComponentLink3URL: https://datasheet.octopart.com:443/GRM188R72A104KA35D-Murata-datasheet-32479577.pdf?src-supplier=Future+Electronics; ComponentLink3Description: https://datasheet.octopart.com:443/GRM188R72A104KA35D-Murata-datasheet-32479577.pdf?src-supplier=Future+Electronics; ComponentLink4URL: https://datasheet.octopart.com:443/GRM188R72A104KA35D-Murata-datasheet-14397338.pdf?src-supplier=Future+Electronics; ComponentLink4Description: https://datasheet.octopart.com:443/GRM188R72A104KA35D-Murata-datasheet-14397338.pdf?src-supplier=Future+Electronics; ComponentLink5URL: https://datasheet.octopart.com:443/GRM188R72A104KA35D-Murata-datasheet-62317223.pdf?src-supplier=element14+APAC; ComponentLink5Description: https://datasheet.octopart.com:443/GRM188R72A104KA35D-Murata-datasheet-62317223.pdf?src-supplier=element14+APAC; ComponentLink6URL: https://datasheet.octopart.com:443/GRM188R72A104KA35D-Murata-datasheet-17853129.pdf?src-supplier=element14+APAC; ComponentLink6Description: https://datasheet.octopart.com:443/GRM188R72A104KA35D-Murata-datasheet-17853129.pdf?src-supplier=element14+APAC; ComponentLink7URL: https://datasheet.octopart.com:443/GRM188R72A104KA35D-Murata-datasheet-8817987.pdf?src-supplier=Newark; ComponentLink7Description: https://datasheet.octopart.com:443/GRM188R72A104KA35D-Murata-datasheet-8817987.pdf?src-supplier=Newark; ComponentLink8URL: https://datasheet.octopart.com:443/GRM188R72A104KA35D-Murata-datasheet-5396244.pdf?src-supplier=_legacy+Avnet; ComponentLink8Description: https://datasheet.octopart.com:443/GRM188R72A104KA35D-Murata-datasheet-5396244.pdf?src-supplier=_legacy+Avnet; ComponentLink9URL: https://datasheet.octopart.com/GRM188R72A104KA35D-Murata-datasheet-12546599.pdf; ComponentLink9Description: https://datasheet.octopart.com/GRM188R72A104KA35D-Murata-datasheet-12546599.pdf; ComponentLink10URL: https://datasheet.octopart.com/GRM188R72A104KA35D-Murata-datasheet-12533551.pdf; ComponentLink10Description: https://datasheet.octopart.com/GRM188R72A104KA35D-Murata-datasheet-12533551.pdf; ComponentLink11URL: https://datasheet.octopart.com/GRM188R72A104KA35D-Murata-datasheet-12515295.pdf; ComponentLink11Description: https://datasheet.octopart.com/GRM188R72A104KA35D-Murata-datasheet-12515295.pdf; ComponentLink12URL: https://datasheet.octopart.com/GRM188R72A104KA35D-Murata-datasheet-12510076.pdf; ComponentLink12Description: https://datasheet.octopart.com/GRM188R72A104KA35D-Murata-datasheet-12510076.pdf; ComponentLink13URL: https://datasheet.octopart.com/GRM188R72A104KA35D-Murata-datasheet-11978611.pdf; ComponentLink13Description: https://datasheet.octopart.com/GRM188R72A104KA35D-Murata-datasheet-11978611.pdf; ComponentLink14URL: https://datasheet.octopart.com/GRM188R72A104KA35D-Murata-datasheet-10025737.pdf; ComponentLink14Description: https://datasheet.octopart.com/GRM188R72A104KA35D-Murata-datasheet-10025737.pdf; ComponentLink15URL: https://datasheet.octopart.com/GRM188R72A104KA35D-Murata-datasheet-8819587.pdf; ComponentLink15Description: https://datasheet.octopart.com/GRM188R72A104KA35D-Murata-datasheet-8819587.pdf; ComponentLink16URL: https://datasheet.octopart.com:443/GRM188R72A104KA35D-Murata-datasheet-165579666.pdf?src-supplier=TME; ComponentLink16Description: https://datasheet.octopart.com:443/GRM188R72A104KA35D-Murata-datasheet-165579666.pdf?src-supplier=TME; ComponentLink17URL: https://datasheet.octopart.com:443/GRM188R72A104KA35D-Murata-datasheet-59876780.pdf?src-supplier=TME; ComponentLink17Description: https://datasheet.octopart.com:443/GRM188R72A104KA35D-Murata-datasheet-59876780.pdf?src-supplier=TME; ComponentLink18URL: https://datasheet.octopart.com:443/GRM188R72A104KA35D-Murata-datasheet-140705814.pdf?src-supplier=Ciiva; ComponentLink18Description: https://datasheet.octopart.com:443/GRM188R72A104KA35D-Murata-datasheet-140705814.pdf?src-supplier=Ciiva; ComponentLink19URL: https://datasheet.octopart.com:443/GRM188R72A104KA35D-Murata-datasheet-138743342.pdf?src-supplier=Ciiva; ComponentLink19Description: https://datasheet.octopart.com:443/GRM188R72A104KA35D-Murata-datasheet-138743342.pdf?src-supplier=Ciiva; ComponentLink20URL: https://datasheet.octopart.com:443/GRM188R72A104KA35D-Murata-datasheet-120101189.pdf?src-supplier=Megastar; ComponentLink20Description: https://datasheet.octopart.com:443/GRM188R72A104KA35D-Murata-datasheet-120101189.pdf?src-supplier=Megastar; ComponentLink21URL: https://datasheet.octopart.com:443/GRM188R72A104KA35D-Murata-datasheet-7591359.pdf?src-supplier=Jameco; ComponentLink21Description: https://datasheet.octopart.com:443/GRM188R72A104KA35D-Murata-datasheet-7591359.pdf?src-supplier=Jameco; ComponentLink22URL: https://datasheet.octopart.com:443/GRM188R72A104KA35D-Murata-datasheet-118811.pdf?src-supplier=DigiKey; ComponentLink22Description: https://datasheet.octopart.com:443/GRM188R72A104KA35D-Murata-datasheet-118811.pdf?src-supplier=DigiKey; ComponentLink23URL: http://sigma.octopart.com:80/reach_statement/Murata-company-16.pdf?src-supplier=Compliance+Statements; ComponentLink23Description: http://sigma.octopart.com:80/reach_statement/Murata-company-16.pdf?src-supplier=Compliance+Statements
D1 = MBR0520LT1G: DIODE SCHOTTKY 20V 500MA SOD123; Manufacturer: onsemi; Manufacturer Lifecycle Status: ACTIVE; Element Configuration: Single; Forward Voltage: 385mV; Max Forward Surge Current (Ifsm): 5.5A; Max Junction Temperature (Tj): 125°C; Max Reverse Leakage Current: 250µA; Number of Elements: 1; Polarity: Standard; Supplier: DigiKey; Supplier Part Number: MBR0520LT1GOSCT-ND; Manufacturer Part Number: MBR0520LT1G; RoHS: Compliant; Category: Schottky Diodes; Stock: 477172; Pricing: 1=0.23, 10=0.142, 100=0.1257, 500=0.093, 1000=0.08242, 3000=0.08118, 6000=0.0779, 9000=0.04525, 15000=0.0422 (USD); Average Rectified Current: 500mA; Breakdown Voltage: 20V; Case/Package: SOD-123-2; China RoHS: Compliant; Contact Plating: Tin; Current Rating: 500mA; Forward Current: 500mA; Height: 1.35mm; Lead Free: Lead Free; Length: 2.69mm; Lifecycle Status: Production; Max Operating Temperature: 125°C; Max Output current: 500mA; Max Repetitive Reverse Voltage (Vrrm): 20V; Max Reverse Voltage (DC): 20V; Max Surge Current: 5.5A; Min Operating Temperature: -65°C; Pins: 2; Number of Terminals: 2; Output Current: 500mA; Packaging: Tape and Reel; Peak Non-Repetitive Surge Current: 5.5A; Peak Reverse Current: 250µA; Radiation Hardening: No; REACH SVHC: Yes; Reverse Standoff Voltage: 20V; Reverse Voltage: 20V; Schedule B: 8541100070, 8541100070|8541100070|8541100070|8541100070|8541100070; Termination: SMD/SMT; Voltage Rating (DC): 20V; Width: 1.6mm; ComponentLink1URL: https://datasheet.octopart.com:443/MBR0520LT1G-ON-Semiconductor-datasheet-11779391.pdf?src-supplier=Newark; ComponentLink1Description: https://datasheet.octopart.com:443/MBR0520LT1G-ON-Semiconductor-datasheet-11779391.pdf?src-supplier=Newark; ComponentLink2URL: https://datasheet.octopart.com:443/MBR0520LT1G-onsemi-datasheet-181959022.pdf?src-supplier=Newark; ComponentLink2Description: https://datasheet.octopart.com:443/MBR0520LT1G-onsemi-datasheet-181959022.pdf?src-supplier=Newark; ComponentLink3URL: https://datasheet.octopart.com:443/MBR0520LT1G-onsemi-datasheet-180961579.pdf?src-supplier=IHS; ComponentLink3Description: https://datasheet.octopart.com:443/MBR0520LT1G-onsemi-datasheet-180961579.pdf?src-supplier=IHS; ComponentLink4URL: https://datasheet.octopart.com:443/MBR0520LT1G-ON-Semiconductor-datasheet-7553569.pdf?src-supplier=Upverter; ComponentLink4Description: https://datasheet.octopart.com:443/MBR0520LT1G-ON-Semiconductor-datasheet-7553569.pdf?src-supplier=Upverter; ComponentLink5URL: https://sigma.octopart.com:443/138897866/technical_drawing/ON-Semiconductor-MBR0520LT1G.pdf?src-supplier=Upverter; ComponentLink5Description: https://sigma.octopart.com:443/138897866/technical_drawing/ON-Semiconductor-MBR0520LT1G.pdf?src-supplier=Upverter; ComponentLink6URL: https://datasheet.octopart.com:443/MBR0520LT1G-onsemi-datasheet-178031877.pdf?src-supplier=Burklin+Elektronik; ComponentLink6Description: https://datasheet.octopart.com:443/MBR0520LT1G-onsemi-datasheet-178031877.pdf?src-supplier=Burklin+Elektronik; ComponentLink7URL: https://datasheet.octopart.com:443/MBR0520LT1G-ON-Semiconductor-datasheet-127372316.pdf?src-supplier=TME; ComponentLink7Description: https://datasheet.octopart.com:443/MBR0520LT1G-ON-Semiconductor-datasheet-127372316.pdf?src-supplier=TME; ComponentLink8URL: https://datasheet.octopart.com:443/MBR0520LT1G-ON-Semiconductor-datasheet-41281291.pdf?src-supplier=Seeed+Studio; ComponentLink8Description: https://datasheet.octopart.com:443/MBR0520LT1G-ON-Semiconductor-datasheet-41281291.pdf?src-supplier=Seeed+Studio; ComponentLink9URL: https://datasheet.octopart.com:443/MBR0520LT1G-ON-Semiconductor-datasheet-9925139.pdf?src-supplier=RS+(Formerly+Allied+Electronics); ComponentLink9Description: https://datasheet.octopart.com:443/MBR0520LT1G-ON-Semiconductor-datasheet-9925139.pdf?src-supplier=RS+(Formerly+Allied+Electronics); ComponentLink10URL: http://sigma.octopart.com:80/150613958/rohs_statement/ON-Semiconductor-MBR0520LT1G.pdf?src-supplier=Compliance+Statements; ComponentLink10Description: http://sigma.octopart.com:80/150613958/rohs_statement/ON-Semiconductor-MBR0520LT1G.pdf?src-supplier=Compliance+Statements; ComponentLink11URL: http://sigma.octopart.com:80/reach_statement/ON-Semiconductor-company-79.pdf?src-supplier=Compliance+Statements; ComponentLink11Description: http://sigma.octopart.com:80/reach_statement/ON-Semiconductor-company-79.pdf?src-supplier=Compliance+Statements; ComponentLink12URL: http://sigma.octopart.com:80/rohs_statement/Fairchild-Semiconductor-company-11.pdf?src-supplier=Compliance+Statements; ComponentLink12Description: http://sigma.octopart.com:80/rohs_statement/Fairchild-Semiconductor-company-11.pdf?src-supplier=Compliance+Statements; ComponentLink13URL: http://sigma.octopart.com:80/rohs_statement/Fairchild-Semiconductor-company-10.pdf?src-supplier=Compliance+Statements; ComponentLink13Description: http://sigma.octopart.com:80/rohs_statement/Fairchild-Semiconductor-company-10.pdf?src-supplier=Compliance+Statements; ComponentLink14URL: http://sigma.octopart.com:80/reach_statement/Fairchild-Semiconductor-company-9.pdf?src-supplier=Compliance+Statements; ComponentLink14Description: http://sigma.octopart.com:80/reach_statement/Fairchild-Semiconductor-company-9.pdf?src-supplier=Compliance+Statements; ComponentLink15URL: https://octopart.com:443/opatz8j6/c1?t=nvlRe1w24RjEsK0UEgFc3PG_FSC3z2p2tDl0CP8s4mwZKp23FCLpCXeuPALGQfGRXZD6CDJXe4k_T0YxUvEoWGGLk7nbZWQjgJfSmCEeF7ND1oEl7Soc0s-WJNWjSUpio9b1yrmfiKm0zblJxYf1trfI3sosjSEiqRglOck6nBT_TDa5DnmeBCUugnnX2-im3lIaigfRheAhoyzeuQWY3vybFXxQ-dYnDVIGUmJ0GRe-z8YOCRd57Hrs96KY13PF8kP3aEcAYTQRMpXjFQuryYw9W0t70NAZEJyFcOEm3-Z0nOi7qNk2Z3xDo25ahOgayCyHJrvaesH8JvkGUYe4bKuAh3tZvvCAzejl&src-supplier=Compliance+Statements; ComponentLink15Description: https://octopart.com:443/opatz8j6/c1?t=nvlRe1w24RjEsK0UEgFc3PG_FSC3z2p2tDl0CP8s4mwZKp23FCLpCXeuPALGQfGRXZD6CDJXe4k_T0YxUvEoWGGLk7nbZWQjgJfSmCEeF7ND1oEl7Soc0s-WJNWjSUpio9b1yrmfiKm0zblJxYf1trfI3sosjSEiqRglOck6nBT_TDa5DnmeBCUugnnX2-im3lIaigfRheAhoyzeuQWY3vybFXxQ-dYnDVIGUmJ0GRe-z8YOCRd57Hrs96KY13PF8kP3aEcAYTQRMpXjFQuryYw9W0t70NAZEJyFcOEm3-Z0nOi7qNk2Z3xDo25ahOgayCyHJrvaesH8JvkGUYe4bKuAh3tZvvCAzejl&src-supplier=Compliance+Statements; ComponentLink16URL: https://octopart.com:443/opatz8j6/c1?t=yGmfHDnAXOd-J6sKWtBLhia-yq4o0snMoPKPE6jC-DOwEw4dx5YsFaiEq6qJ307WI2qMgcJCI-xkOW84bcjJZ1wBcxIZLV5SuCcDuzdJIkT4zgXgfyvnBid64bMNtwmfOp-gjRDtpOazvl-SFhCiuWrx4a52l9ZAWVvnh8rZ4sLNMmZWV-cCrpBdnF-zqW1HrJ_B658mIXcURWZxSWNrVggtuYsJnpS7KTRgtEHSHG66uKlWm05VzA4DhIGQ4b-f5HQ6HJM8bUY42ebsg5t8M-eOB7vXtZJLSMTL12GfNLZgdNkfhNJK3APDgP9qehe4v0LAelQqkxcYs8k-p4t3lExKAsQIbHXiSGg&src-supplier=Compliance+Statements; ComponentLink16Description: https://octopart.com:443/opatz8j6/c1?t=yGmfHDnAXOd-J6sKWtBLhia-yq4o0snMoPKPE6jC-DOwEw4dx5YsFaiEq6qJ307WI2qMgcJCI-xkOW84bcjJZ1wBcxIZLV5SuCcDuzdJIkT4zgXgfyvnBid64bMNtwmfOp-gjRDtpOazvl-SFhCiuWrx4a52l9ZAWVvnh8rZ4sLNMmZWV-cCrpBdnF-zqW1HrJ_B658mIXcURWZxSWNrVggtuYsJnpS7KTRgtEHSHG66uKlWm05VzA4DhIGQ4b-f5HQ6HJM8bUY42ebsg5t8M-eOB7vXtZJLSMTL12GfNLZgdNkfhNJK3APDgP9qehe4v0LAelQqkxcYs8k-p4t3lExKAsQIbHXiSGg&src-supplier=Compliance+Statements